# Altium schematic sheet Enable_Signals.SchDoc
size A4; SheetNumber: 18; SheetTotal: 18
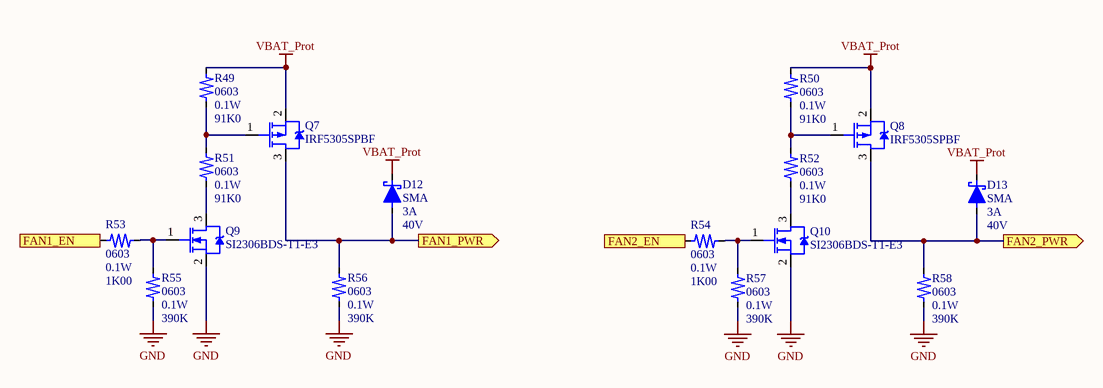
[diagram p0: Enable_Signals.SchDoc]

## Parts
D12  SMA  value 40V  Rating: 3A  [SMA]
D13  SMA  value 40V  Rating: 3A  [SMA]
Q7  IRF5305SPBF  [D2PAK-2]
Q8  IRF5305SPBF  [D2PAK-2]
Q9  SI2306BDS-T1-E3  [SOT-23-3]
Q10  SI2306BDS-T1-E3  [SOT-23-3]
R49  0603  value 91K0  Rating: 0.1W  [R_0603]
R50  0603  value 91K0  Rating: 0.1W  [R_0603]
R51  0603  value 91K0  Rating: 0.1W  [R_0603]
R52  0603  value 91K0  Rating: 0.1W  [R_0603]
R53  0603  value 1K00  Rating: 0.1W  [R_0603]
R54  0603  value 1K00  Rating: 0.1W  [R_0603]
R55  0603  value 390K  Rating: 0.1W  [R_0603]
R56  0603  value 390K  Rating: 0.1W  [R_0603]
R57  0603  value 390K  Rating: 0.1W  [R_0603]
R58  0603  value 390K  Rating: 0.1W  [R_0603]

## Ports
FAN1_EN (in), FAN1_PWR (out), FAN2_EN (in), FAN2_PWR (out)

## Nets
GND: Q9.2(S) Q10.2(S) R55.1(R1) R56.1(R1) R57.1(R1) R58.1(R1)
VBAT_Prot: D12.1(DC) D13.1(DC) Q7.2(S) Q8.2(S) R49.2(R2) R50.2(R2)
FAN1_EN: R53.1(R1) ; port FAN1_EN
FAN1_PWR: D12.2(DA) Q7.3(D) R56.2(R2) ; port FAN1_PWR
FAN2_EN: R54.1(R1) ; port FAN2_EN
FAN2_PWR: D13.2(DA) Q8.3(D) R58.2(R2) ; port FAN2_PWR
NetQ7_1: Q7.1(G) R49.1(R1) R51.2(R2)
NetQ8_1: Q8.1(G) R50.1(R1) R52.2(R2)
NetQ9_1: Q9.1(G) R53.2(R2) R55.2(R2)
NetQ9_3: Q9.3(D) R51.1(R1)
NetQ10_1: Q10.1(G) R54.2(R2) R57.2(R2)
NetQ10_3: Q10.3(D) R52.1(R1)

## Library data of the parts
D12 D13 = SS34A: Part Number: SS34A; Type: Schottky Diode; ID: Dio_SMA_40V_3A_Schottky; Distributor: Lomex; Link: http://lomex.hu/hu/webshop/#/page,0/search,83-02-56/stype,1/sidx,1; Order Number: 83-02-56; Package: SMA; Price (HUF): 19; NI part number: -; NI PEN/DEB: -
Q7 Q8 = IRF5305SPBF: P-Channel Power MOSFET; ID: Tra_D2PAK-2_55V_31A_P-FET; Rating: 31A; Type: P-FET; Value: 55V; Distributor: Lomex; Link: http://lomex.hu/hu/webshop/#/page,0/stype,1/sidx,10/instock,0/search,86-02-47; Order number: 86-02-47; Package: D2PAK-2; Part Number: IRF5305SPBF; Price (HUF): 230; NI part number: -; NI PEN/DEB: -
Q9 Q10 = SI2306BDS-T1-E3: N-Channel Power MOSFET; ID: Tra_SOT-23-3_30V_4A_N-FET; Rating: 4A; Type: N-FET; Value: 30V; Distributor: Lomex; Link: http://lomex.hu/hu/webshop/#/page,0/stype,1/sidx,10/instock,0/search,86-01-57; Order number: 86-01-57; Package: SOT-23-3; Part Number: SI2306BDS-T1-E3; Price (HUF): 83; NI part number: -; NI PEN/DEB: -
R49-R52 = CR-03FL7---91K: NI part number: 612775-01; Tolerance: 1%; Note: NI: 90.9k; ID: Res_0603_91K0_0.1W_Chip; NI PEN/DEB: PEN; Type: Chip Resistor; Part Number: CR-03FL7---91K; Order Number: 80-14-58; Distributor: Lomex; Link: http://lomex.hu/hu/webshop/#/page,0/search,80-14-58/stype,1/sidx,1; Price (HUF): 0.80; Package: 0603
R53 R54 = CR-03FL7----1K: NI part number: 713776-01; Tolerance: 1%; ID: Res_0603_1K00_0.1W_Chip; NI PEN/DEB: DEB; Type: Chip Resistor; Part Number: CR-03FL7----1K; Order Number: 80-11-59; Distributor: Lomex; Link: http://lomex.hu/hu/webshop/#/page,0/search,80-11-59/stype,1/sidx,1; Price (HUF): 0.80; Package: 0603
R55-R58 = CR-03FL7--390K: Tolerance: 1%; ID: Res_0603_390K_0.1W_Chip; Type: Chip Resistor; Part Number: CR-03FL7--390K; Order Number: 80-13-26; Distributor: Lomex; Link: http://lomex.hu/hu/webshop/#/page,0/search,80-13-26/stype,1/sidx,1; Price (HUF): 0.80; Package: 0603; NI part number: -; NI PEN/DEB: -